# EAGLE schematic controller (EAGLE 9.6.2)
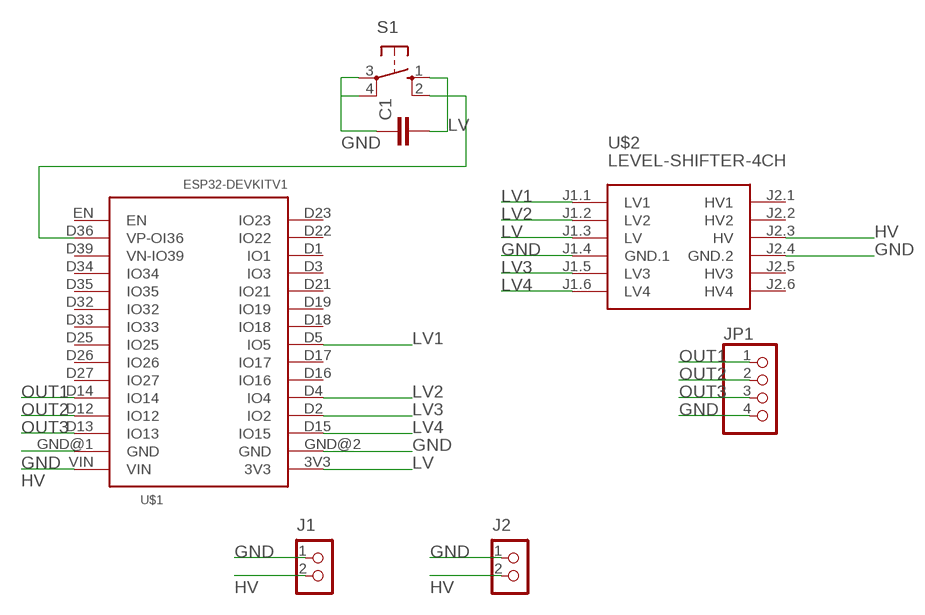
[diagram p0: schematic, sheet 1]

## Parts
C1  C-EU025-025X050  [C025-025X050]
J1  CON_TERMINAL_BLOCK_02-5MM  [TERMINAL_BLOCK_2P_5]
J2  CON_TERMINAL_BLOCK_02-5MM  [TERMINAL_BLOCK_2P_5]
JP1  PINHD-1X4  [1X04]
S1  10-XX  [B3F-10XX]
U$1  ESP32DEVKITV1  [ESP32-DEVKITV1]
U$2  LEVEL-SHIFTER-4CH  [LEVEL-SHIFTER-4CH]

## Nets
GND: C1.1 J1.1 J2.1 JP1.4 S1.3(P) S1.4(P1) U$1.GND@1(GND) U$1.GND@2(GND) U$2.J1.4(GND.1) U$2.J2.4(GND.2)
HV: J1.2 J2.2 U$1.VIN U$2.J2.3(HV)
LV: C1.2 S1.1(S) S1.2(S1) U$1.3V3 U$1.D36(VP-OI36) U$2.J1.3(LV)
LV1: U$1.D5(IO5) U$2.J1.1(LV1)
LV2: U$1.D4(IO4) U$2.J1.2(LV2)
LV3: U$1.D2(IO2) U$2.J1.5(LV3)
LV4: U$1.D15(IO15) U$2.J1.6(LV4)
OUT1: JP1.1 U$1.D14(IO14)
OUT2: JP1.2 U$1.D12(IO12)
OUT3: JP1.3 U$1.D13(IO13)
Unconnected: U$1.D1(IO1) U$1.D3(IO3) U$1.D16(IO16) U$1.D17(IO17) U$1.D18(IO18) U$1.D19(IO19) U$1.D21(IO21) U$1.D22(IO22) U$1.D23(IO23) U$1.D25(IO25) U$1.D26(IO26) U$1.D27(IO27) U$1.D32(IO32) U$1.D33(IO33) U$1.D34(IO34) U$1.D35(IO35) U$1.D39(VN-IO39) U$1.EN U$2.J2.1(HV1) U$2.J2.2(HV2) U$2.J2.5(HV3) U$2.J2.6(HV4)

## Library data of the parts
C1 = rcl:C-EU: CAPACITOR, European symbol; SPICEPREFIX: C
J1 J2 = tblok:CON_TERMINAL_BLOCK_02: 2 poles wire to board terminal block
JP1 = pinhead:PINHD-1X4: PIN HEADER
S1 = switch-omron:10-XX: OMRON SWITCH; MPN: B3F-1000; OC_FARNELL: 176432; OC_NEWARK: 36M3542
U$1 = esp32-devkitv1:ESP32DEVKITV1
U$2 = diy-model:LEVEL-SHIFTER-4CH: 4-Channel Bi-Directional Logic Level Converter based on BSS128 transistors Click here to find device on ebay.com <http://www.ebay.com/sch/i2c+logic+converter+module>